# Altium schematic sheet 4G.SchDoc
size A4
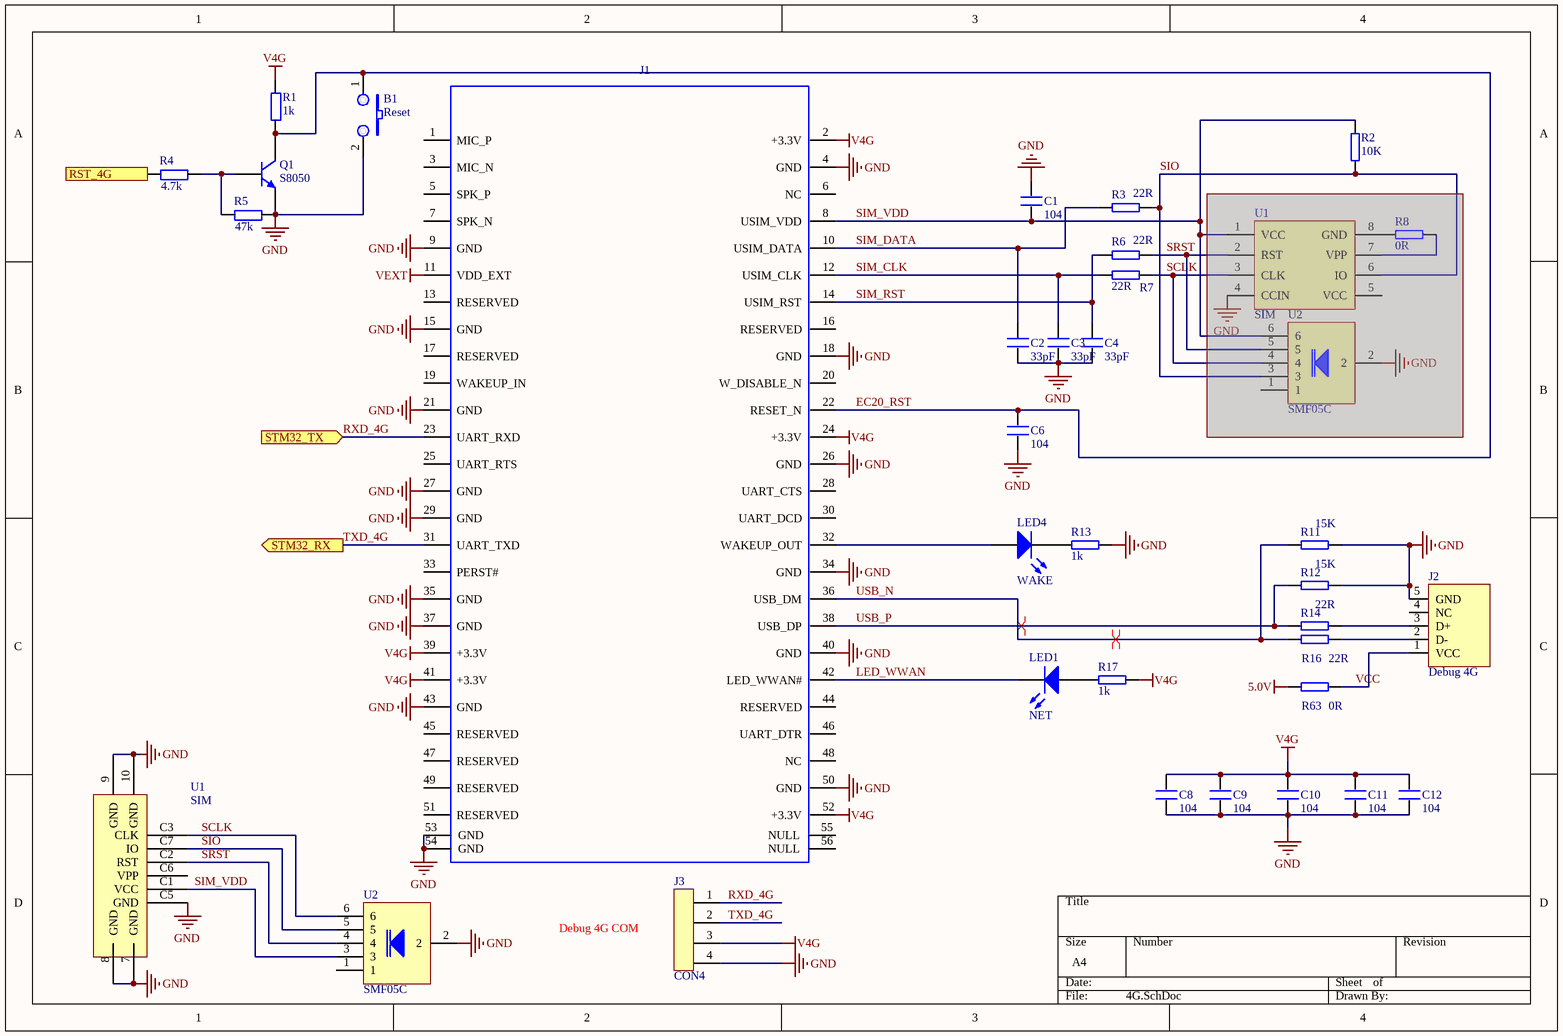
[diagram p0: 4G.SchDoc]

## Parts
(Parts that share a designator on the sheet are numbered #1, #2 ... from top to bottom, then left to right.)
B1  Reset  [3*6*2.5贴片 微动开关]
C1  104  [0603_C]
C2  33pF  [0603_C]
C3  33pF  [0603_C]
C4  33pF  [0603_C]
C6  104  [0603_C]
C8  104  [0603_C]
C9  104  [0603_C]
C10  104  [0603_C]
C11  104  [0603_C]
C12  104  [0603_C]
J1  MINI-PCIE-CON  [EC20_MINIPCI]  (value not drawn)
J2  Debug 4G  [USB_MINI_NEW]
J3  CON4  [CON4(2.54)]
LED1  NET  [LED]
LED4  WAKE  [LED]
Q1  S8050  [SOT-23]
R1  1k  [0603_R]
R2  10K  [0603_R]
R3  22R  [0603_R]
R4  4.7k  [0603_R]
R5  47k  [0603_R]
R6  22R  [0603_R]
R7  22R  [0603_R]
R8  0R  [0603_R]  (masked out: inside a compile mask, not in the netlist)
R11  15K  [0603_R]
R12  15K  [0603_R]
R13  1k  [0603_R]
R14  22R  [0603_R]
R16  22R  [0603_R]
R17  1k  [0603_R]
R63  0R  [0603_R]
U1#1  SIM  [SIM_BIG_POPUP]  (masked out: inside a compile mask, not in the netlist)
U1#2  SIM
U2#1  SMF05C  [SOT363]  (masked out: inside a compile mask, not in the netlist)
U2#2  SMF05C  [SOT363]

## Ports
RST_4G (in), STM32_RX (out), STM32_TX (in)

## Nets
5.0V: R63.2
GND: B1.2 C1.2 C2.2 C3.2 C4.2 C6.2 C8.2 C9.2 C10.2 C11.2 C12.2 J1.4(GND) J1.9(GND) J1.15(GND) J1.18(GND) J1.21(GND) J1.26(GND) J1.27(GND) J1.29(GND) J1.34(GND) J1.35(GND) J1.37(GND) J1.40(GND) J1.43(GND) J1.50(GND) J1.53(GND) J1.54(GND) J1.55(GND) J1.56(GND) J2.5(GND) J3.4 Q1.2 R5.2 R11.1 R12.1 R13.1 U1#2.7(GND) U1#2.8(GND) U1#2.9(GND) U1#2.10(GND) U1#2.C5(GND) U2#2.2
V4G: C8.1 C9.1 C10.1 C11.1 C12.1 J1.2(+3.3V) J1.24(+3.3V) J1.39(+3.3V) J1.41(+3.3V) J1.52(+3.3V) J3.3 R1.2 R17.1
VEXT: J1.11(VDD_EXT)
EC20_RST: B1.1 C6.1 J1.22(RESET_N) Q1.3 R1.1
LED_WWAN: J1.42(LED_WWAN#) LED1.2(K)
RST_4G: R4.1 ; port RST_4G
RXD_4G: J1.23(UART_RXD) J3.1 ; port STM32_TX
SCLK: R7.1 U1#2.C3(CLK) U2#2.6
SIM_CLK: C3.1 J1.12(USIM_CLK) R7.2
SIM_DATA: C2.1 J1.10(USIM_DATA) R3.2
SIM_RST: C4.1 J1.14(USIM_RST) R6.2
SIM_VDD: C1.1 J1.8(USIM_VDD) R2.1 U1#2.C1(VCC) U2#2.3
SIO: R2.2 R3.1 U1#2.C7(IO) U2#2.5
SRST: R6.1 U1#2.C2(RST) U2#2.4
TXD_4G: J1.31(UART_TXD) J3.2 ; port STM32_RX
USB_N: J1.36(USB_DM) R11.2 R16.2
USB_P: J1.38(USB_DP) R12.2 R14.2
VCC: J2.1(VCC) R63.1
NetJ1_32: J1.32(WAKEUP_OUT) LED4.1(A)
NetJ2_2: J2.2(D-) R16.1
NetJ2_3: J2.3(D+) R14.1
NetLED1_1: LED1.1(A) R17.2
NetLED4_2: LED4.2(K) R13.2
NetQ1_1: Q1.1 R4.2 R5.1

Not connected (* = marked no-connect by the designer): J1 1(MIC_P) 3(MIC_N) 5(SPK_P) 6(NC) 7(SPK_N) 13(RESERVED) 16(RESERVED) 17(RESERVED) 19(WAKEUP_IN) 20(W_DISABLE_N) 25(UART_RTS) 28(UART_CTS) 30(UART_DCD) 33(PERST#) 44(RESERVED) 45(RESERVED) 46(UART_DTR) 47(RESERVED) 48(NC) 49(RESERVED) 51(RESERVED); J2 4(NC); U1#2 C6(VPP); U2#2 1

## Layout directives
differential pair: USB_N, USB_P

## Notes on the sheet
- Debug 4G COM

## Library data of the parts
B1 = PUSH BUTTON
C1-C4 C6 C8-C12 = C
J1 = MINI-PCIE-CON: Part Description: Mini PCIe; Value: Latch for Mini PCIe  4.0H 0.8MM pitch 52 circuit with cover lead-free; PCB DECAL: MINI-PCIE-CON
J2 = USB5
LED1 LED4 = LED2: Typical RED, GREEN, YELLOW, AMBER GaAs LED; Published: 8-Jun-2000; LatestRevisionDate: 17-Jul-2002; LatestRevisionNote: Re-released for DXP Platform.; PackageDocument: Feb-2002; PackageReference: 3.2X1.6X1.1; Publisher: Altium Limited
Q1 = NPN
R1 R4 R5 = R
R2 R3 R6-R8 R11-R14 R16 R17 R63 = RES
U1#1 = SIM-抽屉式插卡
U1#2 = MicroSim: 6P自弹MICRO SIM卡座